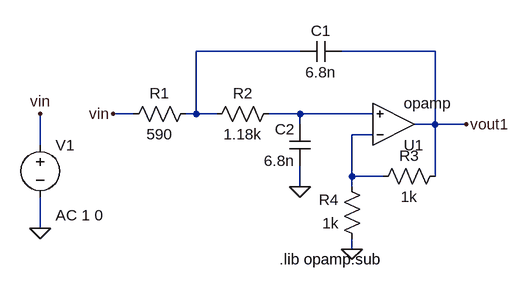
[diagram p0: schematic Draft3.asc]
Draft3.asc, the LTspice schematic file:
Version 4
SHEET 1 880 680
WIRE 176 0 16 0
WIRE 384 0 240 0
WIRE -80 96 -112 96
WIRE 16 96 16 0
WIRE 16 96 0 96
WIRE 48 96 16 96
WIRE 176 96 128 96
WIRE 288 96 176 96
WIRE 176 112 176 96
WIRE 384 112 384 0
WIRE 384 112 352 112
WIRE 432 112 384 112
WIRE 288 128 256 128
WIRE -224 144 -224 96
WIRE 256 192 256 128
WIRE 304 192 256 192
WIRE 384 192 384 112
WIRE 176 208 176 176
WIRE 256 208 256 192
WIRE -224 272 -224 224
WIRE 256 304 256 288
FLAG 256 304 0
FLAG -112 96 vin
FLAG 432 112 vout1
FLAG 176 208 0
FLAG -224 272 0
FLAG -224 96 vin
SYMBOL OpAmps\\opamp 320 176 M180
SYMATTR InstName U1
SYMBOL res 16 80 R90
WINDOW 0 0 56 VBottom 2
WINDOW 3 32 56 VTop 2
SYMATTR InstName R1
SYMATTR Value 590
SYMBOL res 144 80 R90
WINDOW 0 0 56 VBottom 2
WINDOW 3 32 56 VTop 2
SYMATTR InstName R2
SYMATTR Value 1.18k
SYMBOL cap 240 -16 R90
WINDOW 0 0 32 VBottom 2
WINDOW 3 32 32 VTop 2
SYMATTR InstName C1
SYMATTR Value 6.8n
SYMBOL cap 192 176 R180
WINDOW 0 24 56 Left 2
WINDOW 3 24 8 Left 2
SYMATTR InstName C2
SYMATTR Value 6.8n
SYMBOL res 400 176 R90
WINDOW 0 0 56 VBottom 2
WINDOW 3 32 56 VTop 2
SYMATTR InstName R3
SYMATTR Value 1k
SYMBOL res 272 304 R180
WINDOW 0 36 76 Left 2
WINDOW 3 36 40 Left 2
SYMATTR InstName R4
SYMATTR Value 1k
SYMBOL voltage -224 128 R0
WINDOW 123 24 124 Left 2
WINDOW 39 0 0 Left 0
SYMATTR InstName V1
SYMATTR Value ""
SYMATTR Value2 AC 1 0
TEXT 144 320 Left 2 !.lib opamp.sub

The netlist it stands for:
* Draft3.asc
XU1 N003 N002 vout1 opamp Aol=100K GBW=10Meg  ; pins invin noninvin out
R1 N001 vin 590
R2 N002 N001 1.18k
C1 vout1 N001 6.8n
C2 0 N002 6.8n
R3 vout1 N003 1k
R4 0 N003 1k
V1 vin 0 AC 1 0
.lib opamp.sub
.backanno
.end